# EAGLE design main (EAGLE 9.6.2)
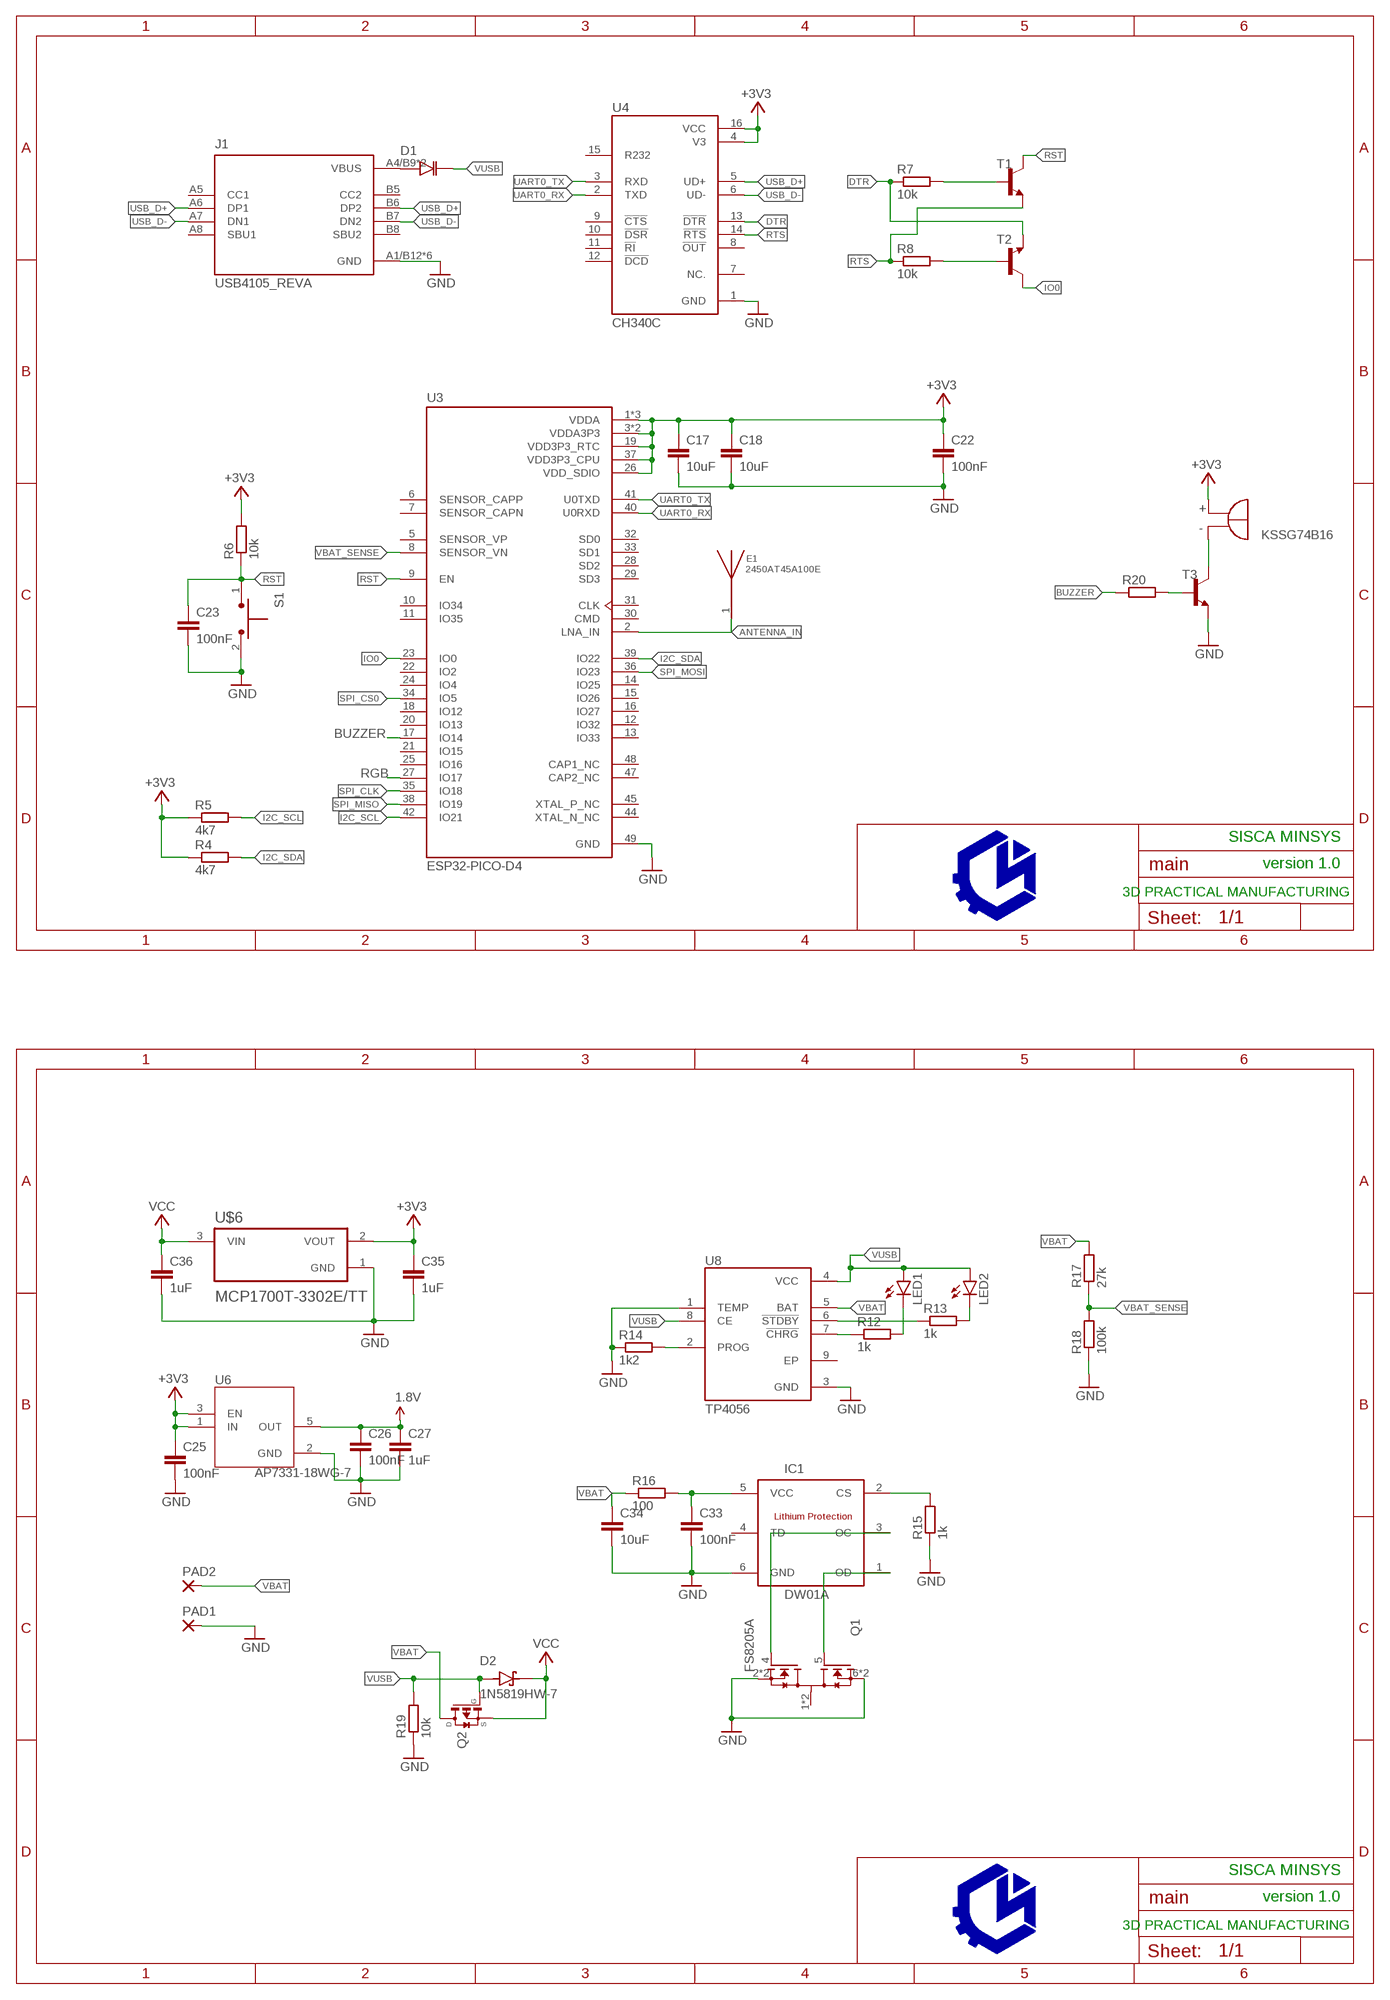
[diagram p0: schematic, sheet 1, part 1 of 2]
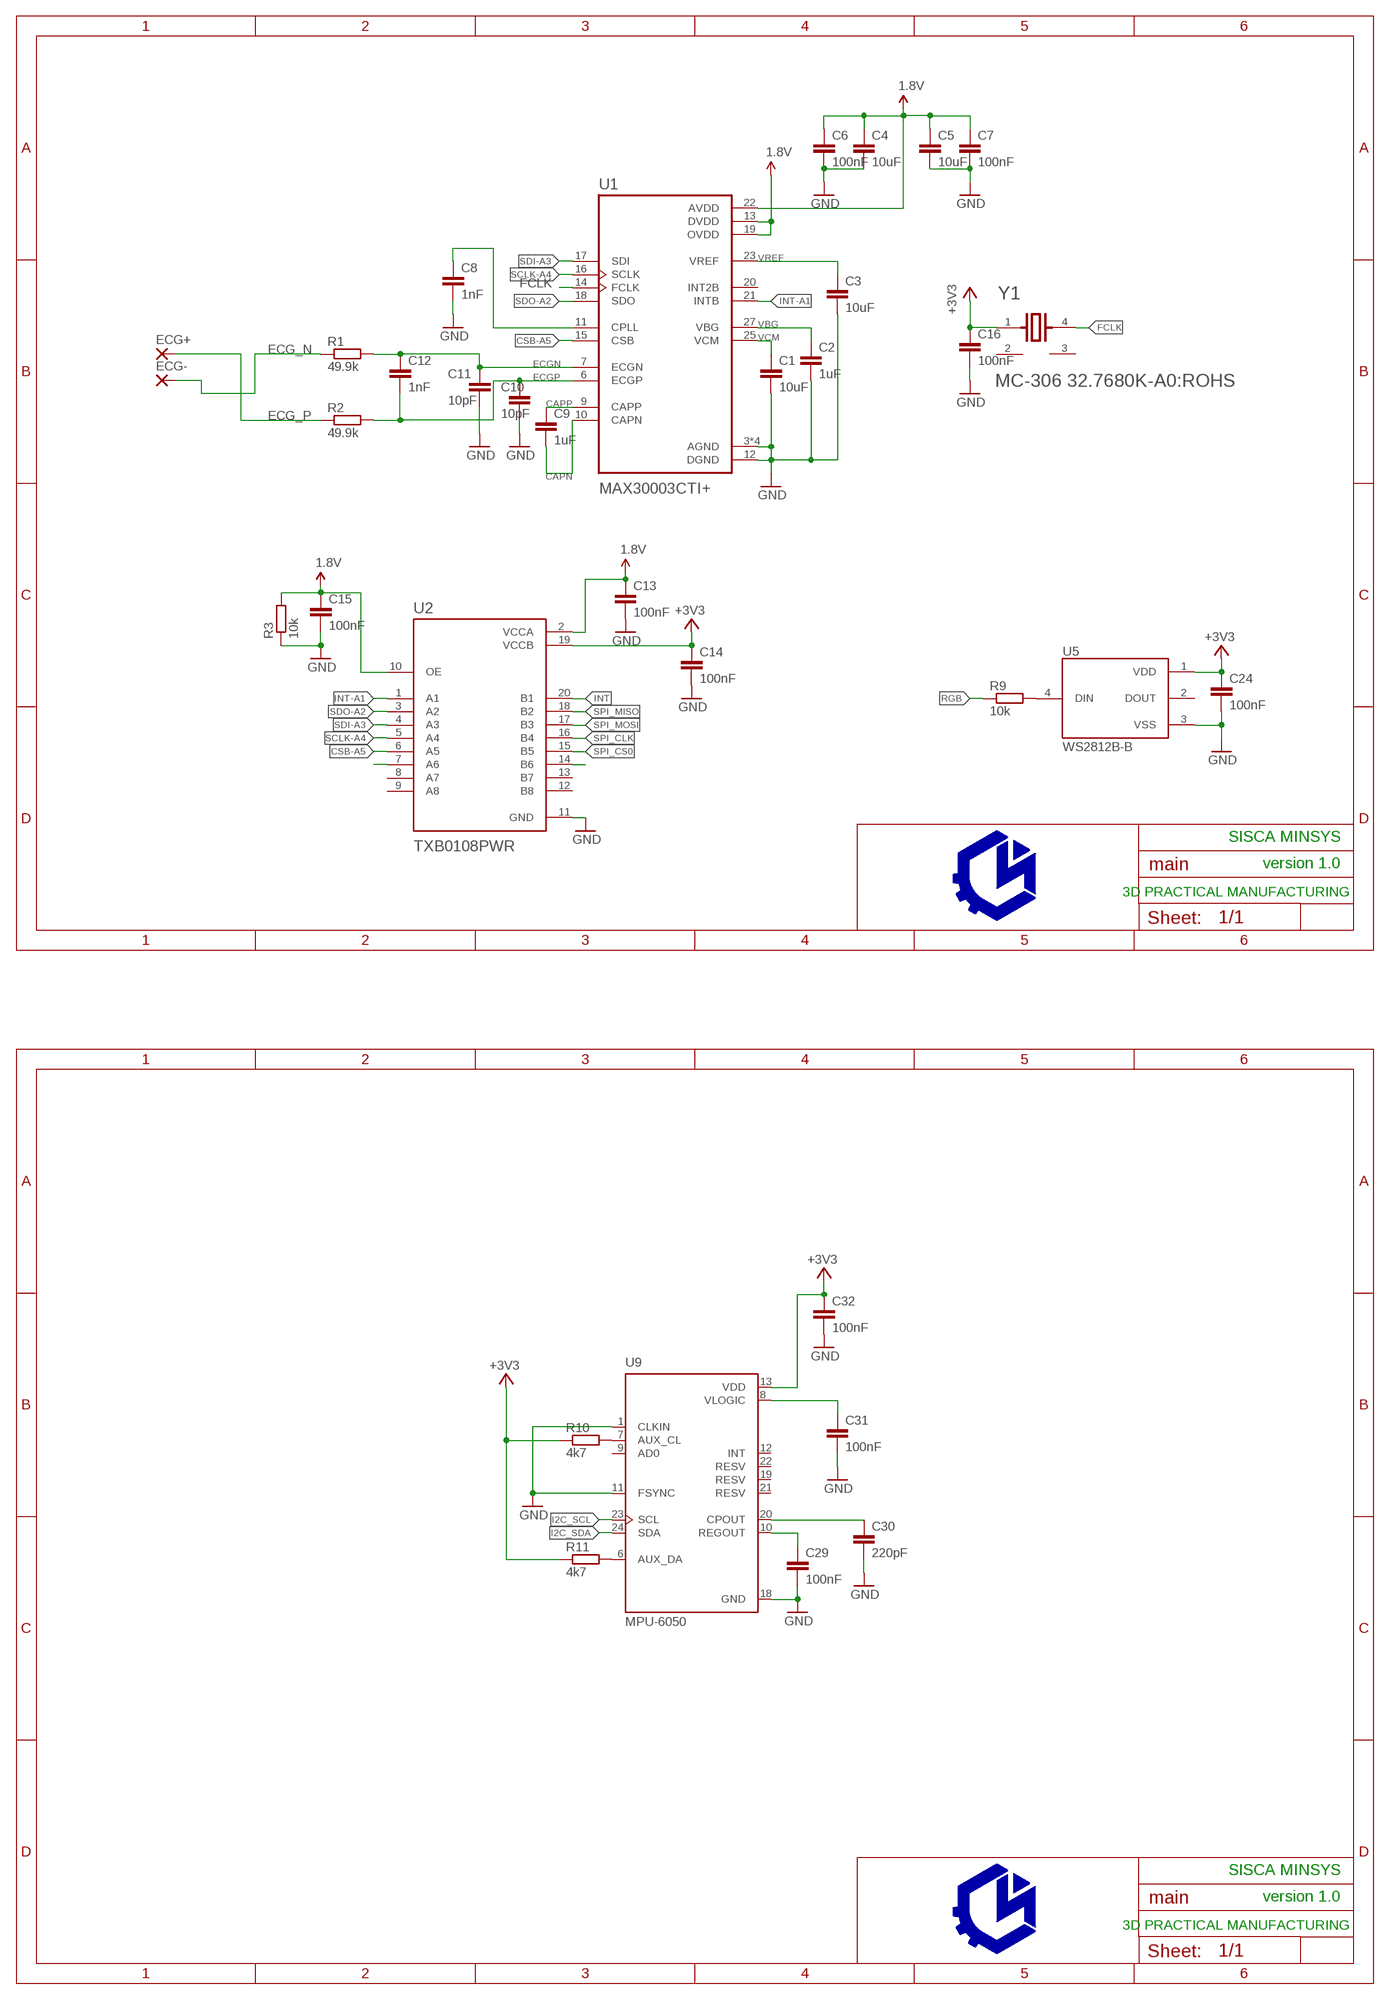
[diagram p1: schematic, sheet 1, part 2 of 2]

## Parts
C1  10uF  C-EUC0603  [C0603]
C2  1uF  C-EUC0603  [C0603]
C3  10uF  C-EUC0603  [C0603]
C4  10uF  C-EUC0603  [C0603]
C5  10uF  C-EUC0603  [C0603]
C6  100nF  C-EUC0603  [C0603]
C7  100nF  C-EUC0603  [C0603]
C8  1nF  C-EUC0603  [C0603]
C9  1uF  C-EUC0603  [C0603]
C10  10pF  C-EUC0603  [C0603]
C11  10pF  C-EUC0603  [C0603]
C12  1nF  C-EUC0603  [C0603]
C13  100nF  C-EUC0603  [C0603]
C14  100nF  C-EUC0603  [C0603]
C15  100nF  C-EUC0603  [C0603]
C16  100nF  C-EUC0603  [C0603]
C17  10uF  C-EUC0603  [C0603]
C18  10uF  C-EUC0603  [C0603]
C22  100nF  C-EUC0603  [C0603]
C23  100nF  C-EUC0603  [C0603]
C24  100nF  C-EUC0603  [C0603]
C25  100nF  C-EUC0603  [C0603]
C26  100nF  C-EUC0603  [C0603]
C27  1uF  C-EUC0603  [C0603]
C29  100nF  C-EUC0603  [C0603]
C30  220pF  C-EUC0603  [C0603]
C31  100nF  C-EUC0603  [C0603]
C32  100nF  C-EUC0603  [C0603]
C33  100nF  C-EUC0603  [C0603]
C34  10uF  C-EUC0603  [C0603]
C35  1uF  C-EUC0603  [C0603]
C36  1uF  C-EUC0603  [C0603]
D1  ZMV829BTA  [SOD2512X116N]
D2  1N5819HW-7  [SOD3715X145N]
E1  2450AT45A100E  [ANT_2450AT45A100E]
ECG+  SMD5  [SMD2,54-5,08]
ECG-  SMD5  [SMD2,54-5,08]
IC1  DW01A  [SOT23-6]
J1  USB4105_REVA  [GCT_USB4105_REVA]
LED1  LEDCHIP-LED0603  [CHIP-LED0603]
LED2  LEDCHIP-LED0603  [CHIP-LED0603]
LS1  KSSG74B16  [XDCR_KSSG74B16]
PAD1  WIREPADSMD1,27-254  [SMD1,27-2,54]
PAD2  WIREPADSMD1,27-254  [SMD1,27-2,54]
Q1  FS8205A  [SOP65P640X120-8N]
Q2  TRANSISTOR-FET_DMP2004K  [TRANSISTOR-FET_SOT23]
R1  49.9k  R-EU_R0603  [R0603]
R2  49.9k  R-EU_R0603  [R0603]
R3  10k  R-EU_R0603  [R0603]
R4  4k7  R-EU_R0603  [R0603]
R5  4k7  R-EU_R0603  [R0603]
R6  10k  R-EU_R0603  [R0603]
R7  10k  R-EU_R0603  [R0603]
R8  10k  R-EU_R0603  [R0603]
R9  10k  R-EU_R0603  [R0603]
R10  4k7  R-EU_R0603  [R0603]
R11  4k7  R-EU_R0603  [R0603]
R12  1k  R-EU_R0603  [R0603]
R13  1k  R-EU_R0603  [R0603]
R14  1k2  R-EU_R0603  [R0603]
R15  1k  R-EU_R0603  [R0603]
R16  100  R-EU_R0603  [R0603]
R17  27k  R-EU_R0603  [R0603]
R18  100k  R-EU_R0603  [R0603]
R19  10k  R-EU_R0603  [R0603]
R20  R-EU_R0603  [R0603]
S1  TL1015AF160QG  [SW_TL1015AF160QG]
T1  MMBT4401LT1-NPN-SOT23-BEC  [SOT23-BEC]
T2  MMBT4401LT1-NPN-SOT23-BEC  [SOT23-BEC]
T3  MMBT4401LT1-NPN-SOT23-BEC  [SOT23-BEC]
U1  MAX30003CTI+  [QFN50P500X500X80-29N]
U2  TXB0108PWR  [SOP65P640X120-20N]
U3  ESP32-PICO-D4  [PQFN50P700X700X104-49N]
U4  CH340C  [SOIC127P600X180-16N]
U5  WS2812B-B  [LED_WS2812B-B]
U6  AP7331-18WG-7  [SOT95P285X145-5N]
U8  TP4056  [SOP127P600X175-9N]
U9  MPU-6050  [QFN50P400X400X95-24N]
U$6  MCP1700T-3302E/TT  [SOT95P237X112-3N]
Y1  EPSON_MC-306_32.7680K-A0-ROHSEPSON_MC-306_32.7680K-A0-ROHS_0_0  [EPSON_MC-306_32.7680K-A0-ROHS_0]

## Nets
1.8V: C4.1 C5.1 C6.1 C7.1 C13.1 C15.1 C26.1 C27.1 R3.2 U1.13(DVDD) U1.19(OVDD) U1.22(AVDD) U2.2(VCCA) U2.10(OE) U6.5(OUT)
+3V3: C14.1 C16.1 C17.1 C18.1 C22.1 C24.1 C25.1 C32.1 C35.1 LS1.P(POS) R4.1 R5.1 R6.2 R10.1 R11.1 U2.19(VCCB) U3.1(VDDA) U3.3(VDDA3P3) U3.4(VDDA3P3) U3.19(VDD3P3_RTC) U3.26(VDD_SDIO) U3.37(VDD3P3_CPU) U3.43(VDDA) U3.46(VDDA) U4.4(V3) U4.16(VCC) U5.1(VDD) U6.1(IN) U6.3(EN) U9.13(VDD) U$6.2(VOUT) Y1.1
ANTENNA_IN: E1.1 U3.2(LNA_IN)
BUZZER: R20.1 U3.17(IO14)
CAPN: C9.2 U1.10(CAPN)
CAPP: C9.1 U1.9(CAPP)
CSB-A5: U1.15(CSB) U2.6(A5)
DTR: R7.1 T2.E U4.13(!DTR)
ECG_N: ECG-.1(P) R1.1
ECG_P: ECG+.1(P) R2.1
ECGN: C11.1 C12.1 R1.2 U1.7(ECGN)
ECGP: C10.1 C12.2 R2.2 U1.6(ECGP)
FCLK: U1.14(FCLK) Y1.4
GND: C1.2 C2.2 C3.2 C4.2 C5.2 C6.2 C7.2 C8.2 C10.2 C11.2 C13.2 C14.2 C15.2 C16.2 C17.2 C18.2 C22.2 C23.2 C24.2 C25.2 C26.2 C27.2 C29.2 C30.2 C31.2 C32.2 C33.2 C34.2 C35.2 C36.2 IC1.6(GND) J1.A1/B12(GND) J1.B1/A12(GND) J1.G1(GND) J1.G2(GND) J1.G3(GND) J1.G4(GND) PAD1.1(P) Q1.2(S1) Q1.3(S1) Q1.6(S2) Q1.7(S2) R3.1 R14.1 R15.1 R18.1 R19.1 S1.2 T3.E U1.3(AGND) U1.8(AGND) U1.12(DGND) U1.28(AGND) U1.29(AGND) U2.11(GND) U3.49(GND) U4.1(GND) U5.3(VSS) U6.2(GND) U8.1(TEMP) U8.3(GND) U9.1(CLKIN) U9.11(FSYNC) U9.18(GND) U$6.1(GND)
I2C_SCL: R5.2 U3.42(IO21) U9.23(SCL)
I2C_SDA: R4.2 U3.39(IO22) U9.24(SDA)
INT: U2.20(B1)
INT-A1: U1.21(INTB) U2.1(A1)
IO0: T2.C U3.23(IO0)
N$1: R7.2 T1.B
N$2: R8.2 T2.B
N$3: R9.2 U5.4(DIN)
N$4: C8.1 U1.11(CPLL)
N$5: R20.2 T3.B
N$6: R10.2 U9.7(AUX_CL)
N$7: R11.2 U9.6(AUX_DA)
N$8: C29.1 U9.10(REGOUT)
N$9: C30.1 U9.20(CPOUT)
N$10: R13.1 U8.6(!STDBY)
N$11: LED1.C R12.2
N$12: LED2.C R13.2
N$13: R12.1 U8.7(!CHRG)
N$14: R14.2 U8.2(PROG)
N$15: IC1.1(OD) Q1.5(G2)
N$16: IC1.3(OC) Q1.4(G1)
N$17: U2.14(B6)
N$18: IC1.2(CS) R15.2
N$19: C33.1 IC1.5(VCC) R16.2
N$20: D1.A J1.A4/B9(VBUS) J1.B4/A9(VBUS)
N$21: C31.1 U9.8(VLOGIC)
N$22: LS1.N(NEG) T3.C
N$23: U2.7(A6)
RGB: R9.1 U3.27(IO17)
RST: C23.1 R6.1 S1.1 T1.C U3.9(EN)
RTS: R8.1 T1.E U4.14(!RTS)
SCLK-A4: U1.16(SCLK) U2.5(A4)
SDI-A3: U1.17(SDI) U2.4(A3)
SDO-A2: U1.18(SDO) U2.3(A2)
SPI_CLK: U2.16(B4) U3.35(IO18)
SPI_CS0: U2.15(B5) U3.34(IO5)
SPI_MISO: U2.18(B2) U3.38(IO19)
SPI_MOSI: U2.17(B3) U3.36(IO23)
UART0_RX: U3.40(U0RXD) U4.2(TXD)
UART0_TX: U3.41(U0TXD) U4.3(RXD)
USB_D+: J1.A6(DP1) J1.B6(DP2) U4.5(UD+)
USB_D-: J1.A7(DN1) J1.B7(DN2) U4.6(UD-)
VBAT: C34.1 PAD2.1(P) Q2.3(D) R16.1 R17.2 U8.5(BAT)
VBAT_SENSE: R17.1 R18.2 U3.8(SENSOR_VN)
VBG: C2.1 U1.27(VBG)
VCC: C36.1 D2.C(K) Q2.2(S) U$6.3(VIN)
VCM: C1.1 U1.25(VCM)
VREF: C3.1 U1.23(VREF)
VUSB: D1.K D2.A LED1.A LED2.A Q2.1(G) R19.2 U8.4(VCC) U8.8(CE)
Unconnected: IC1.4(TD) J1.A5(CC1) J1.A8(SBU1) J1.B5(CC2) J1.B8(SBU2) Q1.1(D12) Q1.8(D12) U1.20(INT2B) U2.8(A7) U2.9(A8) U2.12(B8) U2.13(B7) U3.5(SENSOR_VP) U3.6(SENSOR_CAPP) U3.7(SENSOR_CAPN) U3.10(IO34) U3.11(IO35) U3.12(IO32) U3.13(IO33) U3.14(IO25) U3.15(IO26) U3.16(IO27) U3.18(IO12) U3.20(IO13) U3.21(IO15) U3.22(IO2) U3.24(IO4) U3.25(IO16) U3.28(SD2) U3.29(SD3) U3.30(CMD) U3.31(CLK) U3.32(SD0) U3.33(SD1) U3.44(XTAL_N_NC) U3.45(XTAL_P_NC) U3.47(CAP2_NC) U3.48(CAP1_NC) U4.7(NC.) U4.8(!OUT) U4.9(!CTS) U4.10(!DSR) U4.11(!RI) U4.12(!DCD) U4.15(R232) U5.2(DOUT) U8.9(EP) U9.9(AD0) U9.12(INT) U9.19(RESV) U9.21(RESV) U9.22(RESV) Y1.2(1_NC) Y1.3(2_NC)

## Notes on the sheet
- SISCA MINSYS | SISCA MINSYS
- version 1.0 | version 1.0
- 3D PRACTICAL MANUFACTURING | 3D PRACTICAL MANUFACTURING
- SISCA MINSYS | SISCA MINSYS
- version 1.0 | version 1.0
- 3D PRACTICAL MANUFACTURING | 3D PRACTICAL MANUFACTURING

## Library data of the parts
C1-C18 C22-C27 C29-C36 = rcl:C-EU: CAPACITOR, European symbol; SPICEPREFIX: C
D1 = ZMV829BTA:ZMV829BTA: Varactors Single 25V Surface Mount SOD-323 Check availability; AVAILABILITY: In Stock; DESCRIPTION: Varactors Single 25 V Surface Mount SOD-323; MF: Diodes Inc.; MP: ZMV829BTA; PACKAGE: SOD-323 Diodes Inc.; PRICE: None; PURCHASE-URL: https://pricing.snapeda.com/search/part/ZMV829BTA/?ref=eda
D2 = 1N5819HW-7:1N5819HW-7: 1N5819HW Series 40 V 1 A Surface Mount Schottky Barrier Rectifier - SOD-123 Check availability; AVAILABILITY: In Stock; DESCRIPTION: Diode Schottky 40 V 1A Surface Mount SOD-123; MF: Diodes Inc.; MP: 1N5819HW-7; PACKAGE: SOD-123 Fairchild Semiconductor; PRICE: None; PURCHASE-URL: https://pricing.snapeda.com/search/part/1N5819HW-7/?ref=eda
E1 = 2450AT45A100E:2450AT45A100E: ANTENNA, CERAMIC, 2.45GHZ; Bandwidth: 100MHz; Frequency: 2.45GHz; Gain: 1dB; Impedance: 50ohm Check availability; AVAILABILITY: In Stock; DESCRIPTION: 2.4GHz - Chip RF Antenna 2.4GHz ~ 2.5GHz 2.2dBi Solder Surface Mount; MF: Johanson Technology; MP: 2450AT45A100E; PACKAGE: None; PRICE: None; PURCHASE-URL: https://pricing.snapeda.com/search/part/2450AT45A100E/?ref=eda
ECG+ ECG- = wirepad:SMD5: SMD PAD
IC1 = DW01A:DW01A: Check availability; AVAILABILITY: Not in stock; DESCRIPTION: One Cell Lithium-ion/Polymer Battery Protection IC; MF: Fortune Semiconductor; MP: DW01A; PACKAGE: SOT-23-6 Fortune Semiconductor; PRICE: None
J1 = USB4105_REVA:USB4105_REVA: USB Type C Receptacle for USB 2.0 SMT Type, PCB Top Mount; AVAILABILITY: Unavailable; DESCRIPTION: USB-C (USB TYPE-C) USB 2.0 Receptacle Connector 24 (16+8 Dummy) Position Surface Mount, Right Angle; Through Hole; MF: Global Connector Technology; MP: USB4105; PACKAGE: Package; PRICE: None
LED1 LED2 = led:LED: LED OSRAM: - CHIPLED LG R971, LG N971, LY N971, LG Q971, LY Q971, LO R971, LY R971 LH N974, LH R974 LS Q976, LO Q976, LY Q976 LO Q996 - Hyper CHIPLED LW Q18S LB Q993, LB Q99A, LB R99A - SideLED LS A670, LO A670, LY A670, LG A670, LP A670 LB A673, LV A673, LT A673, LW A673 LH A674 LY A675 LS A676, LA A676, LO A676, LY A676, LW A676 LS A679, LY A679, LG A679 - Hyper Micro SIDELED® LS Y876, LA Y876, LO Y876, LY Y876 LT Y87S - SmartLED LW L88C, LW L88S LB L89C, LB L89S, LG L890 LS L89K, LO L89K, LY L89K LS L896, LA L896, LO L896, LY L896 - TOPLED LS T670, LO T670, LY T670, LG T670, LP T670 LSG T670, LSP T670, LSY T670, LOP T670, LYG T670 LG T671, LOG T671, LSG T671 LB T673, LV T673, LT T673, LW T673 LH T674 LS T676, LA T676, LO T676, LY T676, LB T676, LH T676, LSB T676, LW T676 LB T67C, LV T67C, LT T67C, LS T67K, LO T67K, LY T67K, LW E67C LS E67B, LA E67B, LO E67B, LY E67B, LB E67C, LV E67C, LT E67C LW T67C LS T679, LY T679, LG T679 LS T770, LO T770, LY T770, LG T770, LP T770 LB T773, LV T773, LT T773, LW T773 LH T774 LS E675, LA E675, LY E675, LS T675 LS T776, LA T776, LO T776, LY T776, LB T776 LHGB T686 LT T68C, LB T68C - Hyper Mini TOPLED® LB M676 - Mini TOPLED Santana® LG M470 LS M47K, LO M47K, LY M47K Source: http://www.osram.convergy.de LUXEON: - LUMILED® LXK2-PW12-R00, LXK2-PW12-S00, LXK2-PW14-U00, LXK2-PW14-V00 LXK2-PM12-R00, LXK2-PM12-S00, LXK2-PM14-U00 LXK2-PE12-Q00, LXK2-PE12-R00, LXK2-PE12-S00, LXK2-PE14-T00, LXK2-PE14-U00 LXK2-PB12-K00, LXK2-PB12-L00, LXK2-PB12-M00, LXK2-PB14-N00, LXK2-PB14-P00, LXK2-PB14-Q00 LXK2-PR12-L00, LXK2-PR12-M00, LXK2-PR14-Q00, LXK2-PR14-R00 LXK2-PD12-Q00, LXK2-PD12-R00, LXK2-PD12-S00 LXK2-PH12-R00, LXK2-PH12-S00 LXK2-PL12-P00, LXK2-PL12-Q00, LXK2-PL12-R00 Source: www.luxeon.com KINGBRIGHT: KA-3528ASYC Source: www.kingbright.com
LS1 = KSSG74B16:KSSG74B16: Check availability; AVAILABILITY: In Stock; DESCRIPTION: 8.5mm, 3.6V, 2.73KHz, 87dB, High SPL Magnetic Buzzer, SMT; MF: Kingstate; MP: KSSG74B16; PACKAGE: DIP-16 kingstate; PRICE: None
PAD1 PAD2 = wirepad:WIREPAD: Wire PAD connect wire on PCB
Q1 = FS8205A:FS8205A: N/A Check availability; AVAILABILITY: Not in stock; MF: Fortune Semiconductor; MP: FS8205A; PACKAGE: Package; PRICE: None
Q2 = 52101-101-REV-A_v16:TRANSISTOR-FET_DMP2004K: P-Channel Enhancement MOSFET
R1-R20 = rcl:R-EU_: RESISTOR, European symbol; SPICEPREFIX: R
S1 = TL1015AF160QG:TL1015AF160QG: Tactile Switch SPST-NO Top Actuated Surface Mount Check prices; AVAILABILITY: In Stock; DESCRIPTION: Tactile Switch SPST-NO Top Actuated Surface Mount; MF: E-Switch; MP: TL1015AF160QG; PACKAGE: SOIC-14 E-Switch; PRICE: None; PURCHASE-URL: https://pricing.snapeda.com/search/part/TL1015AF160QG/?ref=eda
T1-T3 = DC_LOAD_AU:*-NPN-: NPN Transistror BF959 corrected 2008.03.06
U1 = MAX30003CTI_:MAX30003CTI+: None Check availability; AVAILABILITY: In Stock; DESCRIPTION: ECG Front End 28-TQFN (5x5); MF: Maxim Integrated; MP: MAX30003CTI+; PACKAGE: TQFN-28 Maxim; PRICE: None; PURCHASE-URL: https://pricing.snapeda.com/search/part/MAX30003CTI+/?ref=eda
U2 = TXB0108PWR:TXB0108PWR: 8-Bit Bidirectional Voltage-Level Shifter with Auto Direction Sensing and +/-15-kV ESD Protect 20-TSSOP -40 to 85 Check availability; AVAILABILITY: In Stock; DESCRIPTION: 8-Bit Bidirectional Voltage-Level Shifter with Auto Direction Sensing and +/-15-kV ESD Protect; MF: Texas Instruments; MP: TXB0108PWR; PACKAGE: TSSOP-20 Texas Instruments; PRICE: None; PURCHASE-URL: https://pricing.snapeda.com/search/part/TXB0108PWR/?ref=eda
U3 = ESP32-PICO-D4:ESP32-PICO-D4: Bluetooth, WiFi 802.11b/g/n, Bluetooth v4.2 +EDR, Class 1, 2 and 3 Transceiver Module 2.4GHz ~ 2.5GHz Surface Mount Check availability; AVAILABILITY: In Stock; DESCRIPTION: Bluetooth, WiFi 802.11b/g/n, Bluetooth v4.2 +EDR, Class 1, 2 and 3 Transceiver Module 2.4GHz ~ 2.5GHz - Surface Mount; MF: Espressif Systems; MP: ESP32-PICO-D4; PACKAGE: SMD-48 Espressif Systems; PRICE: None; PURCHASE-URL: https://pricing.snapeda.com/search/part/ESP32-PICO-D4/?ref=eda
U4 = CH340C:CH340C: USB to serial chip CH340 Check availability; AVAILABILITY: Not in stock; DESCRIPTION: USB to serial chip CH340; MF: WCH; MP: CH340C; PACKAGE: None; PRICE: None
U5 = WS2812B-B:WS2812B-B: Intelligent control LED integrated light source Check availability; AVAILABILITY: Not in stock; DESCRIPTION: Intelligent control LED integrated light source; MF: Worldsemi; MP: WS2812B-B; PACKAGE: Package; PRICE: None
U6 = AP7331-18WG-7:AP7331-18WG-7: LDO Regulator Pos 1.8V 0.3A 5-Pin SOT-25 T/R Check availability; AVAILABILITY: In Stock; DESCRIPTION: Linear Voltage Regulator IC Positive Fixed 1 Output 300mA SOT-25; MF: Diodes Inc.; MP: AP7331-18WG-7; PACKAGE: SOT-753 Diodes Inc.; PRICE: None; PURCHASE-URL: https://pricing.snapeda.com/search/part/AP7331-18WG-7/?ref=eda
U8 = TP4056:TP4056: Complete single cell Li-Ion battery with a constant current / constant voltage linear charger Check availability; AVAILABILITY: Not in stock; DESCRIPTION: Complete single cell Li-Ion battery with a constant current / constant voltage linear charger; MF: NanJing Top Power ASIC Corp.; MP: TP4056; PACKAGE: None; PRICE: None
U9 = MPU-6050:MPU-6050: MPU-6050 Six-Axis (Gyro + Accelerometer) MEMS MotionTracking™ Devices Check availability; AVAILABILITY: In Stock; DESCRIPTION: MPU-6050 series Accelerometer, Gyroscope, 3 Axis Sensor Evaluation Board; MF: TDK InvenSense; MP: MPU-6050; PACKAGE: QFN-24 InvenSense; PRICE: None; PURCHASE-URL: https://pricing.snapeda.com/search/part/MPU-6050/?ref=eda
U$6 = MCP1700T-3302E_TT:MCP1700T-3302E/TT: Check availability; AVAILABILITY: In Stock; DESCRIPTION: Linear Voltage Regulator IC Positive Fixed 1 Output 250mA SOT-23-3; MF: Microchip; MP: MCP1700T-3302E/TT; PACKAGE: SOT-23 Microchip; PRICE: None; PURCHASE-URL: https://pricing.snapeda.com/search/part/MCP1700T-3302E/TT/?ref=eda
Y1 = Epson - MC-306 32.7680K-A0_ROHS:EPSON_MC-306_32.7680K-A0-ROHS: CRYSTAL 32.7680KHZ 12.5PF SMD; CENTROID_NOT_SPECIFIED: No; DATASHEET: http://media.digikey.com/pdf/Data%20Sheets/Epson%20PDFs/MC-306%20,405,%20406.pdf; DIGIKEY_DESCRIPTION: CRYSTAL 32.7680KHZ 12.5PF SMD; DIGIKEY_PART_NUMBER: SER2407CT-ND; LEAD_FREE: yes; MF: Epson; MOUSER_PART_NUMBER: 732-MC30632.7680KA0R; MPN: MC-306 32.7680K-A0:ROHS; PACKAGE: SMT_XTAL_8MM0_3MM20; PREFIX: Y; ROHS: yes; TEMPERATURE_RANGE_HIGH: +85°C; TEMPERATURE_RANGE_LOW: -40°C

## Board
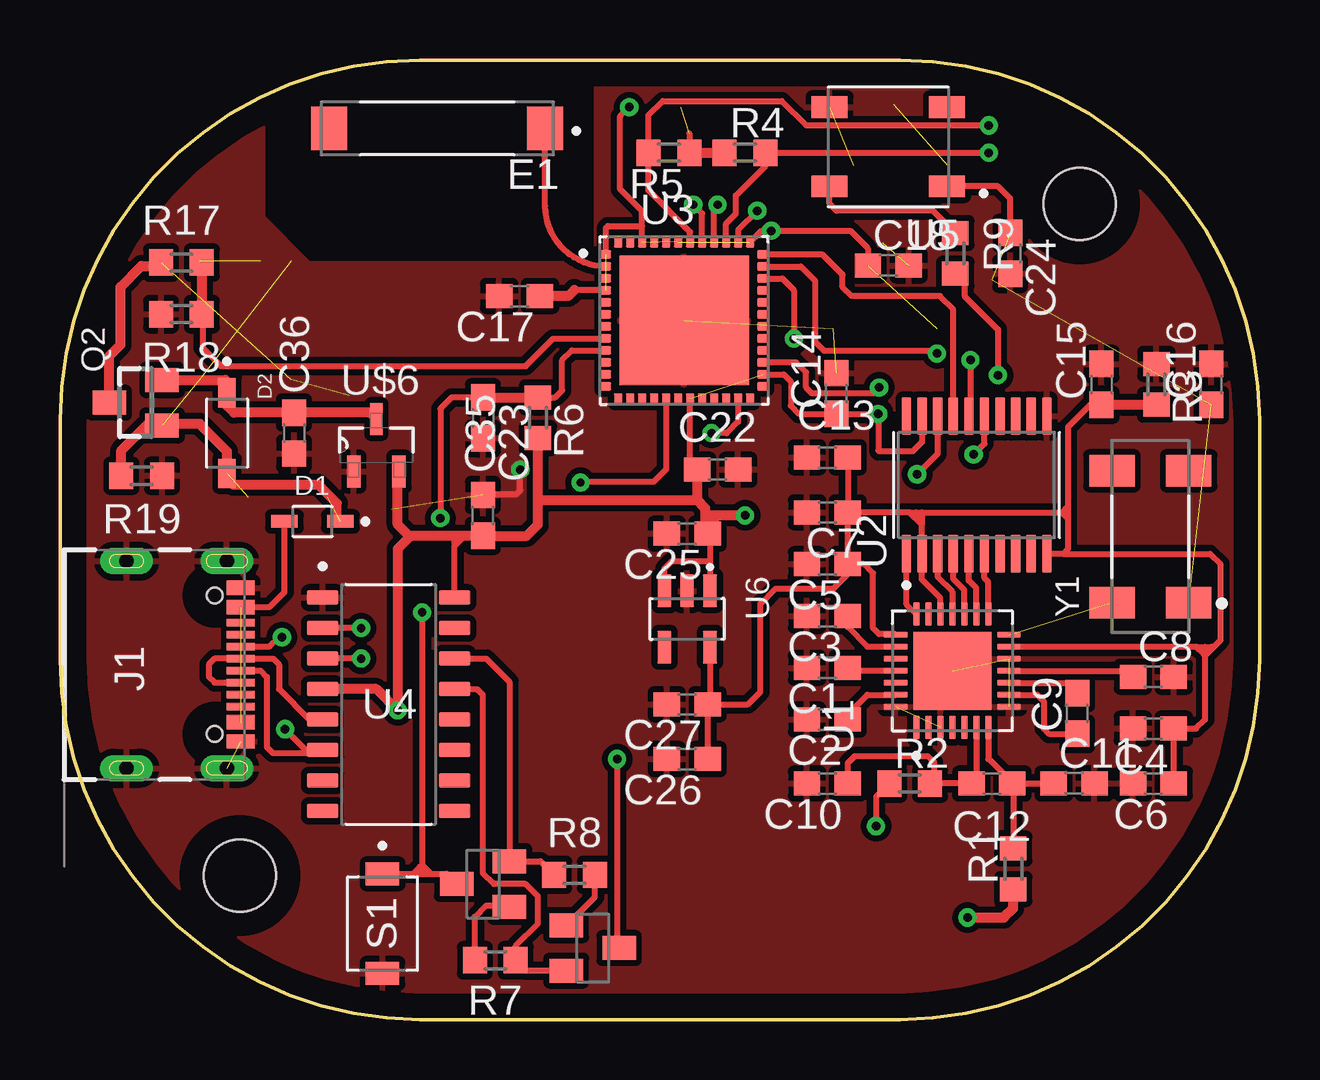
[diagram p2: board, top side]
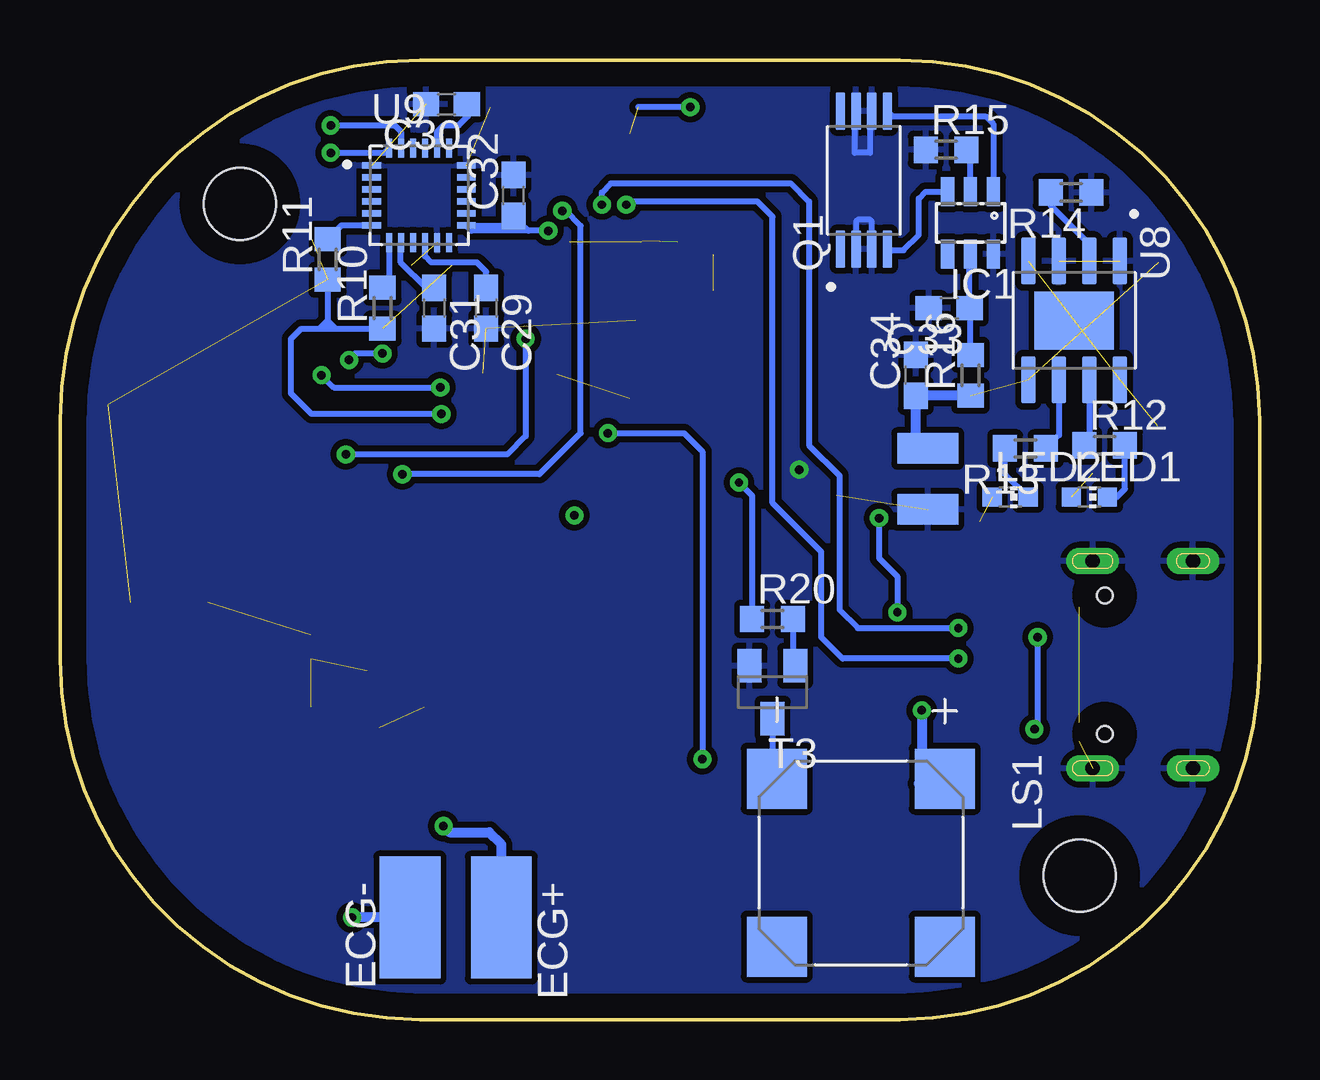
[diagram p3: board, bottom side, seen from below]

Size 50 x 40 mm. Coordinates in mm from the lower left corner, seen from the top.
Outline: 0,25 0,15 arc90 15,0 35,0 arc90 50,15 50,25 arc90 35,40 15,40 arc90 0,25
Copper layers (1*16): Top 0.035mm / dielectric 1.5mm / Bottom 0.035mm
Design rules "default": minimum track width 6mil, minimum drill 0.35mm, track to track 6mil, track to pad 6mil, pad to pad 6mil, via to via 6mil, smd to smd 6mil, copper to edge 40mil, drill to drill 6mil, minimum pad ring 10mil, minimum via ring 8mil, stop-mask expansion 4mil, vias tented up to drill 0mil, thermal gap 10mil
Holes 3 mm at 42.5,34 7.5,6

### Footprints (pad centres in the part's own frame; a part is rotated, then mirrored left to right if it is on the bottom)
C0603 = smd 1.1 x 1: 1 -0.85,0; 2 0.85,0
SOD2512X116N = smd 1.11 x 0.52: A 1.165,0; K -1.165,0
SOD3715X145N = smd 1.21 x 0.73: A 1.68,0; C -1.68,0
ANT_2450AT45A100E = smd 1.5 x 1.8: 1 -4.5,0; 2 4.5,0
SMD2,54-5,08 = smd 2.54 x 5.08: 1 0,0
SOT23-6 = smd 0.55 x 1.2: 1 -0.95,-1.3; 2 0,-1.3; 3 0.95,-1.3; 4 0.95,1.3; 5 0,1.3; 6 -0.95,1.3
GCT_USB4105_REVA = smd 0.6 x 1.15: A1/B12 -3.2,4.755; A4/B9 -2.4,4.755; B1/A12 3.2,4.755; B4/A9 2.4,4.755 | smd 0.3 x 1.15: A5 -1.25,4.755; A6 -0.25,4.755; A7 0.25,4.755; A8 1.25,4.755; B5 1.75,4.755; B6 0.75,4.755; B7 -0.75,4.755; B8 -1.75,4.755 | drill 0.6 pad 1 long: G1 -4.32,0; G2 4.32,0 | drill 0.6 pad 1.05 long: G3 -4.32,4.18; G4 4.32,4.18 | hole 0.65: 2.89,3.68; -2.89,3.68
CHIP-LED0603 = smd 0.8 x 0.8: A 0,-0.75; C 0,0.75
XDCR_KSSG74B16 = smd 2.5 x 2.5: N -3.5,-3.5; NC1 3.5,3.5; NC2 3.5,-3.5; P -3.5,3.5
SMD1,27-2,54 = smd 1.27 x 2.54: 1 0,0
SOP65P640X120-8N = smd 1.56 x 0.4: 1 -2.88,0.975; 2 -2.88,0.325; 3 -2.88,-0.325; 4 -2.88,-0.975; 5 2.88,-0.975; 6 2.88,-0.325; 7 2.88,0.325; 8 2.88,0.975
TRANSISTOR-FET_SOT23 = smd 1 x 1.4: 1 -0.95,-1.1; 2 0.95,-1.1; 3 0,1.1
R0603 = smd 1 x 1.1: 1 -0.85,0; 2 0.85,0
SW_TL1015AF160QG = smd 0.95 x 1.4: 1 -2.075,0; 2 2.075,0
SOT23-BEC = smd 1 x 1.4: B -0.95,-1.1; C 0,1.1; E 0.95,-1.1
QFN50P500X500X80-29N = smd 0.99 x 0.27: 1 -2.36,1.5; 2 -2.36,1; 3 -2.36,0.5; 4 -2.36,0; 5 -2.36,-0.5; 6 -2.36,-1; 7 -2.36,-1.5; 15 2.36,-1.5; 16 2.36,-1; 17 2.36,-0.5; 18 2.36,0; 19 2.36,0.5; 20 2.36,1; 21 2.36,1.5 | smd 0.27 x 0.99: 8 -1.5,-2.36; 9 -1,-2.36; 10 -0.5,-2.36; 11 0,-2.36; 12 0.5,-2.36; 13 1,-2.36; 14 1.5,-2.36; 22 1.5,2.36; 23 1,2.36; 24 0.5,2.36; 25 0,2.36; 26 -0.5,2.36; 27 -1,2.36; 28 -1.5,2.36 | smd 3.25 x 3.25: 29 0,0
SOP65P640X120-20N = smd 1.57 x 0.41: 1 -2.87,2.925; 2 -2.87,2.275; 3 -2.87,1.625; 4 -2.87,0.975; 5 -2.87,0.325; 6 -2.87,-0.325; 7 -2.87,-0.975; 8 -2.87,-1.625; 9 -2.87,-2.275; 10 -2.87,-2.925; 11 2.87,-2.925; 12 2.87,-2.275; 13 2.87,-1.625; 14 2.87,-0.975; 15 2.87,-0.325; 16 2.87,0.325; 17 2.87,0.975; 18 2.87,1.625; 19 2.87,2.275; 20 2.87,2.925
PQFN50P700X700X104-49N = smd 0.45 x 0.35: 1 -3.265,2.75; 2 -3.265,2.25; 3 -3.265,1.75; 4 -3.265,1.25; 5 -3.265,0.75; 6 -3.265,0.25; 7 -3.265,-0.25; 8 -3.265,-0.75; 9 -3.265,-1.25; 10 -3.265,-1.75; 11 -3.265,-2.25; 12 -3.265,-2.75; 25 3.265,-2.75; 26 3.265,-2.25; 27 3.265,-1.75; 28 3.265,-1.25; 29 3.265,-0.75; 30 3.265,-0.25; 31 3.265,0.25; 32 3.265,0.75; 33 3.265,1.25; 34 3.265,1.75; 35 3.265,2.25; 36 3.265,2.75 | smd 0.35 x 0.45: 13 -2.75,-3.265; 14 -2.25,-3.265; 15 -1.75,-3.265; 16 -1.25,-3.265; 17 -0.75,-3.265; 18 -0.25,-3.265; 19 0.25,-3.265; 20 0.75,-3.265; 21 1.25,-3.265; 22 1.75,-3.265; 23 2.25,-3.265; 24 2.75,-3.265; 37 2.75,3.265; 38 2.25,3.265; 39 1.75,3.265; 40 1.25,3.265; 41 0.75,3.265; 42 0.25,3.265; 43 -0.25,3.265; 44 -0.75,3.265; 45 -1.25,3.265; 46 -1.75,3.265; 47 -2.25,3.265; 48 -2.75,3.265 | smd 5.4 x 5.4: 49 0,0
SOIC127P600X180-16N = smd 1.31 x 0.62: 1 -2.75,4.445; 2 -2.75,3.175; 3 -2.75,1.905; 4 -2.75,0.635; 5 -2.75,-0.635; 6 -2.75,-1.905; 7 -2.75,-3.175; 8 -2.75,-4.445; 9 2.75,-4.445; 10 2.75,-3.175; 11 2.75,-1.905; 12 2.75,-0.635; 13 2.75,0.635; 14 2.75,1.905; 15 2.75,3.175; 16 2.75,4.445
LED_WS2812B-B = smd 1.5 x 0.9: 1 -2.45,1.65; 2 -2.45,-1.65; 3 2.45,-1.65; 4 2.45,1.65
SOT95P285X145-5N = smd 1.37 x 0.59: 1 -1.175,0.95; 2 -1.175,0; 3 -1.175,-0.95; 4 1.175,-0.95; 5 1.175,0.95
SOP127P600X175-9N = smd 1.97 x 0.6: 1 -2.475,1.905; 2 -2.475,0.635; 3 -2.475,-0.635; 4 -2.475,-1.905; 5 2.475,-1.905; 6 2.475,-0.635; 7 2.475,0.635; 8 2.475,1.905 | smd 2.413 x 3.302: 9 0,0
QFN50P400X400X95-24N = smd 0.79 x 0.26: 1 -1.97,1.25; 2 -1.97,0.75; 3 -1.97,0.25; 4 -1.97,-0.25; 5 -1.97,-0.75; 6 -1.97,-1.25; 13 1.97,-1.25; 14 1.97,-0.75; 15 1.97,-0.25; 16 1.97,0.25; 17 1.97,0.75; 18 1.97,1.25 | smd 0.26 x 0.79: 7 -1.25,-1.97; 8 -0.75,-1.97; 9 -0.25,-1.97; 10 0.25,-1.97; 11 0.75,-1.97; 12 1.25,-1.97; 19 1.25,1.97; 20 0.75,1.97; 21 0.25,1.97; 22 -0.25,1.97; 23 -0.75,1.97; 24 -1.25,1.97
SOT95P237X112-3N = smd 1.321 x 0.559: 1 -1.092,0.94; 2 -1.092,-0.94 | smd 1.321 x 0.508: 3 1.092,0
EPSON_MC-306_32.7680K-A0-ROHS_0 = smd 1.3 x 1.9: 1 -2.75,-1.6; 2 2.75,-1.6; 3 2.75,1.6; 4 -2.75,1.6

### Placement (x,y rotation side)
C1  31.98,14.67 180 top
C2  31.98,12.51 180 top
C3  31.98,16.82 180 top
C4  45.57,12.13 180 top
C5  31.98,18.98 180 top
C6  45.57,9.84 180 top
C7  31.98,21.14 180 top
C8  45.57,14.29 0 top
C9  42.4,12.76 90 top
C10  31.98,9.84 180 top
C11  42.27,9.84 0 top
C12  38.84,9.84 180 top
C13  31.98,23.43 180 top
C14  32.37,26.1 90 top
C15  43.41,26.48 90 top
C16  47.99,26.48 90 top
C17  19.16,30.16 180 top
C18  34.52,31.43 0 top
C22  27.41,22.92 0 top
C23  17.63,25.08 270 top
C24  39.61,31.94 270 top
C25  26.14,20.25 180 top
C26  26.14,10.86 180 top
C27  26.14,13.14 180 top
C29  32.24,29.65 270 bottom
C30  33.89,38.16 180 bottom
C31  34.4,29.65 270 bottom
C32  31.1,34.35 90 bottom
C33  12.94,29.65 180 bottom
C34  14.33,26.86 90 bottom
C35  17.63,21.02 90 top
C36  9.76,24.45 270 top
D1  10.52,20.76 180 top
D2  6.97,24.45 270 top
E1  15.73,37.14 180 top
ECG+  31.6,4.25 0 bottom
ECG-  35.41,4.25 0 bottom
IC1  12.05,33.21 180 bottom
J1  2.77,14.79 270 top
LED1  7.09,21.78 270 bottom
LED2  10.39,21.78 270 bottom
LS1  16.62,6.54 270 bottom
PAD1  13.82,21.27 90 bottom
PAD2  13.82,23.81 270 bottom
Q1  16.49,34.99 90 bottom
Q2  3.16,25.71 90 top
R1  39.73,6.28 90 top
R2  35.41,9.84 0 top
R3  45.7,26.48 270 top
R4  28.56,36.13 0 top
R5  25.38,36.13 180 top
R6  19.92,25.08 270 top
R7  18.14,2.47 180 top
R8  21.44,6.03 0 top
R9  37.32,31.94 90 top
R10  36.56,29.65 90 bottom
R11  38.84,31.68 90 bottom
R12  6.46,23.94 0 bottom
R13  9.76,23.81 180 bottom
R14  7.86,34.48 180 bottom
R15  13.06,36.26 0 bottom
R16  12.05,26.86 90 bottom
R17  5.06,31.56 180 top
R18  5.06,29.4 0 top
R19  3.41,22.67 180 top
R20  20.3,16.7 0 bottom
S1  13.44,4 270 top
T1  17.63,5.65 90 top
T2  22.21,2.98 270 top
T3  20.3,13.65 180 bottom
U1  37.19,14.54 90 top
U2  38.21,22.29 90 top
U3  26.02,29.14 0 top
U4  13.7,13.14 0 top
U5  34.52,36.38 180 top
U6  26.14,16.7 270 top
U8  7.73,29.14 270 bottom
U9  35.03,34.35 0 bottom
U$6  13.19,23.94 90 top
Y1  45.45,20.13 90 top

### Tracks (layer width: path | path; a pad name or v marks a point on that pad's centre or on a via)
1.8V
  Top 0.254: 47.73,15.17 47.73,12.51 47.35,12.13 C4.1 C6.1 | 47.73,15.17 47.67,15.24 | 47.67,15.24 47.37,15.54 | 47.37,15.54 U1.13 | C5.1 C7.1 | C13.1 C7.1 | U1.19 36.69,17.58 35.92,18.35 35.92,19.41 U2.2 35.92,20.64 | U6.5 27.09,13.24 C27.1 | C27.1 C26.1 | C27.1 28.68,13.14 29.19,13.65 29.19,17.33 29.83,17.97 32.24,17.97 32.84,18.56 C5.1 | 35.92,20.64 35.41,21.14 | 35.41,21.14 C7.1 | U1.22 34.81,16.06 34.14,16.06 33.89,16.32 33.89,18.6 33.51,18.98 C5.1 | C15.1 42.95,25.63 42.02,24.7 42.02,21.4 | 42.02,21.4 42.02,21.14 | 42.02,21.14 42.02,20.89 | 42.02,20.89 42.02,19.62 41.81,19.42 | 41.81,19.42 U2.10 | 41.81,19.42 47.94,19.42 48.37,18.98 48.37,15.81 48.1,15.54 | 48.1,15.54 48.05,15.49 | 48.05,15.49 47.73,15.17 | 47.37,15.54 47.73,15.54 | 47.73,15.54 48,15.54 | 48,15.54 48.05,15.49 | 47.73,15.54 47.73,15.3 47.67,15.24 | 48,15.54 48.1,15.54 | 35.41,21.14 35.67,21.14 | 35.67,21.14 35.92,21.14 | 35.92,21.14 41.76,21.14 | 42.02,21.14 41.76,21.14 | 35.92,21.14 35.92,20.89 | 35.92,20.89 35.92,20.64 | 35.67,21.14 35.92,20.89 | 41.76,21.14 42.02,20.89 | 41.76,21.14 42.02,21.4
  Top 0.406: C15.1 R3.2
+3V3  (via drill 0.35)  (10 unrouted)
  Top 0.254: U3.4 22.73,30.41 21.44,30.41 | U3.43 25.72,32.45 | U4.16 16.45,19.75 | 16.45,19.87 16.45,20.12 16.49,20.17 | 16.45,19.87 16.45,19.75 | 16.45,19.87 16.74,20.17 | 16.45,19.75 16.87,20.17 17,20.17 | C22.1 26.27,23.22 U3.19 | 27.09,18.98 27.09,20.15 C25.1 26.95,20.3 26.89,20.36 | 27.09,18.98 U6.1 | U6.3 25.19,18.8 25.51,19.11 26.97,19.11 27.09,18.98 | U2.19 35.93,24.07 35.54,23.68 34.14,23.68 34.11,23.72 v34.11,25.25 C14.1 30.8,25.25 30.46,25.59 30.46,26.6 30.17,26.89 U3.26 | C18.1 33.67,32.15 32.95,32.88 v29.64,32.88 29.24,32.88 U3.37 | C24.1 39.61,34.22 39.1,34.73 U5.1 | U3.46 24.27,33.08 | 24.27,33.08 24.27,33.69 23.35,34.61 23.35,37.65 v23.73,38.03 | 26.23,36.93 R5.1 | U3.1 22.75,32.99 22.84,33.08 24.27,33.08
  Top 0.406: 14.55,20.17 16.49,20.17 16.74,20.17 17,20.17 C35.1 19.45,20.17 19.92,20.64 19.92,21.65 | 14.55,20.17 14.08,20.64 14.08,22.79 U$6.2 | 19.92,21.65 R6.2 | 19.92,21.65 26.54,21.65 | 26.54,21.65 26.89,21.31 26.89,21.02 | 26.89,21.02 26.89,20.36 | 21.44,30.41 21.19,30.16 C17.1 | 14.55,20.17 14.55,20.09 14.08,19.62 v14.08,12.89 13.19,13.78 U4.4 | R5.1 R4.1 | C22.1 26.54,22.9 26.54,21.65 | v28.56,21.02 27.41,21.02 | 27.41,21.02 26.89,21.02 | 27.41,21.02 26.95,20.55 26.95,20.3
  Bottom 0.254: 38.72,30.71 R11.1 38.84,29.14 | v34.11,25.25 39.52,25.25 40.37,26.1 40.37,28.38 39.95,28.8 39.19,28.8 | 39.19,28.8 38.84,28.8 | 38.84,28.8 38.5,28.8 | 38.5,28.8 R10.1 | 38.84,29.14 38.84,28.8 | 38.84,29.14 38.5,28.8 | 38.84,29.14 39.19,28.8 | v23.73,38.03 25.89,38.03 | v29.64,32.88 30.48,32.88 | 30.48,32.88 30.82,33.23 | 30.82,33.23 C32.1 | 30.82,33.23 30.95,33.1 U9.13 32.84,32.88 30.48,32.88
  Bottom 0.406: v14.08,12.89 14.08,9.97 14.21,9.84 13.32,9.84 LS1.P
ANTENNA_IN
  Top 0.254: U3.2 arc-90 20.23,33.92 E1.1
BUZZER  (via drill 0.35)
  Top 0.254: U3.17 25.27,22.93 24.75,22.41 21.73,22.41 v21.7,22.38
  Bottom 0.254: v21.7,22.38 21.15,21.84 R20.1
CAPN
  Top 0.254: U1.10 41.97,14.04 C9.2
CAPP
  Top 0.254: U1.9 40.73,13.54 41,13.27 41,12.13 41.22,11.91 C9.1
CSB-A5
  Top 0.254: U1.15 38.69,18.25 38.53,18.41 U2.6
DTR
  Top 0.254: T2.E 19.43,2.03 R7.1 18.99,3.07 19.92,4 19.92,5.14 19.41,5.65 18.09,5.65 17.63,6.1 17.63,13.52 17.44,13.71 17.38,13.78 U4.13
ECG_N  (via drill 0.35)
  Top 0.406: v37.83,4.25 39.35,4.25 39.73,4.63 R1.1
  Bottom 0.406: ECG-.1 v37.83,4.25
ECG_P  (via drill 0.35)
  Top 0.254: R2.1 34.02,9.29 v34.02,8.06
  Bottom 0.406: ECG+.1 31.6,7.3 32.11,7.81 33.76,7.81 v34.02,8.06
ECGN
  Top 0.254: C12.1 C11.1 | C12.1 39.73,9.8 R1.2 | U1.7 38.69,10.86 38.72,10.86 39.69,9.88 C12.1
ECGP
  Top 0.254: 36.43,9.84 C12.2 38.19,9.84 U1.6 | 36.43,9.84 R2.2 | C10.1 32.84,10.69 33.13,10.98 36.18,10.98 36.43,10.73 36.43,9.84
FCLK  (1 unrouted)
GND  (via drill 0.35)  (11 unrouted)
  Top 0.254: C35.2 17.67,21.91 19.03,21.91 19.19,22.06 v19.19,22.92
  Bottom 0.254: Q1.6 16.24,37.8 16.24,36.13 16.87,36.13 16.87,37.81 Q1.7 | Q1.3 16.17,33.26 16.24,33.34 16.74,33.34 16.82,33.26 Q1.2
  pour Bottom (isolate 0.254): -1.04,39.94 -1.04,-0.32 50.65,-0.32 50.65,39.94
  pour Top (isolate 0.254): -0.91,-0.7 46.84,-0.7 49.89,2.35 49.89,35.88 45.45,40.32 22.33,40.32 22.33,32.06 21.82,31.56 10.39,31.56 8.49,33.46 8.49,38.41 7.22,39.69 1.38,39.69 -0.91,37.4
I2C_SCL  (via drill 0.35)
  Top 0.254: U3.42 26.27,32.83 24.53,34.57 R5.2 24.53,37.69 25.13,38.29 30.08,38.29 31.1,37.27 v38.72,37.27
  Bottom 0.254: U9.23 35.78,37.01 36.05,37.27 v38.72,37.27
I2C_SDA  (via drill 0.35)
  Top 0.254: U3.39 27.77,33.18 28.18,33.59 28.18,34.35 29.41,35.58 R4.2 v38.72,36.13
  Bottom 0.254: v38.72,36.13 36.48,36.13 U9.24
INT-A1
  Top 0.254: U1.21 35.28,17.31 U2.1
IO0  (via drill 0.35)
  Top 0.254: U3.23 28.27,24.92 27.79,24.45 v27.16,24.45 | v23.22,10.86 23.22,3.07 T2.C
  Bottom 0.254: v27.16,24.45 23.98,24.45 23.22,23.68 v23.22,10.86
N$1
  Top 0.254: R7.2 17.29,4.29 17.76,4.76 18.67,4.76 T1.B
N$2
  Top 0.254: T2.B 22.29,5.12 R8.2
N$3
  Top 0.254: R9.2 36.39,33.72 32.37,33.72 32.08,34.01 U5.4
N$4
  Top 0.254: U1.11 44.47,14.54 C8.1
N$5
  Bottom 0.254: R20.2 19.45,14.85 T3.B
N$6
  Bottom 0.254: U9.7 36.28,30.78 R10.2
N$7
  Bottom 0.254: U9.6 38.28,33.1 R11.2
N$8
  Bottom 0.254: C29.1 32.24,31.18 32.62,31.56 34.52,31.56 34.78,31.81 U9.10
N$9
  Bottom 0.254: U9.20 34.27,36.33 34.27,37.02 34.02,37.27 33.38,37.27 33,37.65 33,38.12 C30.1
N$10
  Bottom 0.254: U8.6 8.36,24.36 R13.1
N$11
  Bottom 0.254: LED1.C 5.95,21.78 5.61,22.12 R12.2
N$12
  Bottom 0.254: LED2.C 10.61,22.74 R13.2
N$13
  Bottom 0.254: U8.7 7.09,24.15 R12.1
N$14
  Bottom 0.254: U8.2 7.09,32.32 8.7,33.93 R14.2
N$15
  Bottom 0.254: Q1.5 15.3,37.65 11.41,37.65 11.1,37.34 IC1.1
N$16
  Bottom 0.254: Q1.4 15.47,32.06 14.84,32.06 14.21,32.7 14.21,34.22 13.92,34.51 IC1.3
N$18
  Bottom 0.254: IC1.2 12.05,36.09 R15.2
N$19
  Bottom 0.254: IC1.5 12.09,31.87 C33.1 12.05,29.61 R16.2
N$20  (1 unrouted)
  Top 0.254: J1.A4/B9 7.54,17.21 8.74,17.21 9.36,17.82 D1.A
N$21
  Bottom 0.254: U9.8 35.8,32.37 35.8,31.56 34.74,30.5 C31.1
N$22
  Bottom 0.254: T3.C 20.3,10.22 LS1.N
RGB  (via drill 0.35)
  Top 0.254: R9.1 37.7,30.71 37.7,30.16 39.1,28.76 v39.1,26.86 | v34.14,26.35 33.89,26.1 31.35,26.1 31.1,26.35 31.1,26.98 30.69,27.39 U3.27
  Bottom 0.254: v39.1,26.86 38.59,26.35 v34.14,26.35
RST  (via drill 0.35)
  Top 0.254: S1.1 14.71,6.07 | 14.71,6.07 15.09,6.07 | 15.09,6.07 15.47,6.07 | 15.47,6.07 16.11,6.07 T1.C | R6.1 20.64,25.93 20.94,26.22 20.94,27.49 21.34,27.89 U3.9 | C23.1 16.32,25.93 15.86,25.46 v15.86,20.9 15.86,20.76 | v15.09,16.98 15.09,6.45 | 14.71,6.07 15.01,6.37 | 15.01,6.37 15.09,6.45 | 15.09,6.45 15.47,6.07 | 15.01,6.37 15.09,6.28 15.09,6.07
  Top 0.406: C23.1 R6.1
  Bottom 0.254: v15.86,20.9 15.86,19.24 15.09,18.48 v15.09,16.98 15.09,16.95
RTS
  Top 0.254: R8.1 20.02,6.6 T1.E 18.73,14.07 17.76,15.05 U4.14
SCLK-A4
  Top 0.254: U1.16 38.19,17.99 37.88,18.3 U2.5
SDI-A3
  Top 0.254: U1.17 37.69,17.92 37.23,18.38 U2.4
SDO-A2
  Top 0.254: U2.3 36.58,18.45 37.19,17.84 U1.18
SPI_CLK  (via drill 0.35)
  Top 0.254: U3.35 30.88,31.39 31.48,30.8 31.48,28.26 31.86,27.87 36.45,27.87 v36.56,27.77 | v37.95,27.49 37.95,25.23 U2.16
  Bottom 0.254: v36.56,27.77 37.68,27.77 v37.95,27.49
SPI_CS0  (via drill 0.35)
  Top 0.254: 38.59,25.21 U2.15 38.53,24.01 v38.08,23.56 | U3.34 30.11,30.89 30.59,30.41 v30.59,28.38
  Bottom 0.254: v30.59,28.38 30.59,24.32 31.35,23.56 v38.08,23.56
SPI_MISO  (via drill 0.35)
  Top 0.254: 36.56,25.18 U2.18 36.58,23.58 v35.73,22.73 | v29.06,33.72 28.27,32.92 U3.38
  Bottom 0.254: v29.06,33.72 28.94,33.72 28.3,33.08 28.3,24.45 30.02,22.73 v35.73,22.73
SPI_MOSI
  Top 0.254: U2.17 37.23,29.61 36.68,30.16 33,30.16 32.62,30.54 32.62,31.05 31.77,31.89 U3.36
UART0_RX  (via drill 0.35)
  Top 0.254: U3.40 27.27,33.82 v27.41,33.97 | v12.55,16.32 U4.2
  Bottom 0.254: v27.41,33.97 27.41,34.48 27.03,34.86 19.54,34.86 18.78,34.1 18.78,23.94 17.51,22.67 17.51,17.08 16.74,16.32 v12.55,16.32
UART0_TX  (via drill 0.35)
  Top 0.254: v12.55,15.05 U4.3 | v26.4,33.97 26.77,33.6 U3.41
  Bottom 0.254: v26.4,33.97 26.27,34.1 20.94,34.1 20.3,33.46 20.3,21.52 18.27,19.49 18.27,15.94 17.38,15.05 v12.55,15.05
USB_D+
  Top 0.254: U4.5 10.39,12.51 9.12,13.78 9.12,14.79 8.88,15.04 J1.A6 6.45,15.04 6.2,14.79 6.2,14.29 6.45,14.04 J1.B6
USB_D-  (via drill 0.35)
  Top 0.254: J1.A7 8.36,14.54 8.62,14.29 8.62,11.36 8.87,11.11 10.37,11.11 | J1.B7 7.54,15.55 8.74,15.55 9.12,15.94 v9.25,15.94 | v9.38,12.1 10.37,11.11 | U4.6 10.82,11.11 10.37,11.11
  Bottom 0.254: v9.38,12.1 9.25,12.23 v9.25,15.94
VBAT  (2 unrouted)
  Top 0.406: Q2.3 2.06,27.66 2.52,28.13 2.52,30.54 3.39,31.41 4.06,31.41 | R17.2 4.06,31.41 | 4.06,31.41 3.96,31.3
  Bottom 0.406: R16.1 C34.1 14.33,24.32 PAD2.1
VBAT_SENSE
  Top 0.254: R18.2 5.95,29.36 5.95,28 6.71,27.24 19.41,27.24 20.55,28.38 22.74,28.38 U3.8
  Top 0.406: R17.1 R18.2
VBG
  Top 0.254: C2.1 32.84,12.72 33.65,13.54 U1.27
VCC
  Top 0.406: Q2.2 6.91,26.66 6.97,26.6 D2.C 6.97,25.59 7.26,25.3 C36.1 12.92,25.3 U$6.3
VCM
  Top 0.254: U1.25 32.96,14.54 C1.1 32.87,14.63
VREF
  Top 0.254: U1.23 33.65,15.54 32.84,16.36 C3.1
VUSB  (4 unrouted)
  Top 0.406: D1.K 11.54,20.91 11.54,21.52 10.78,22.29 7.22,22.29 6.97,22.54 D2.A 6.97,23.68 5.82,24.83 4.32,24.83 Q2.1 3.6,24.77 2.56,23.72 R19.2